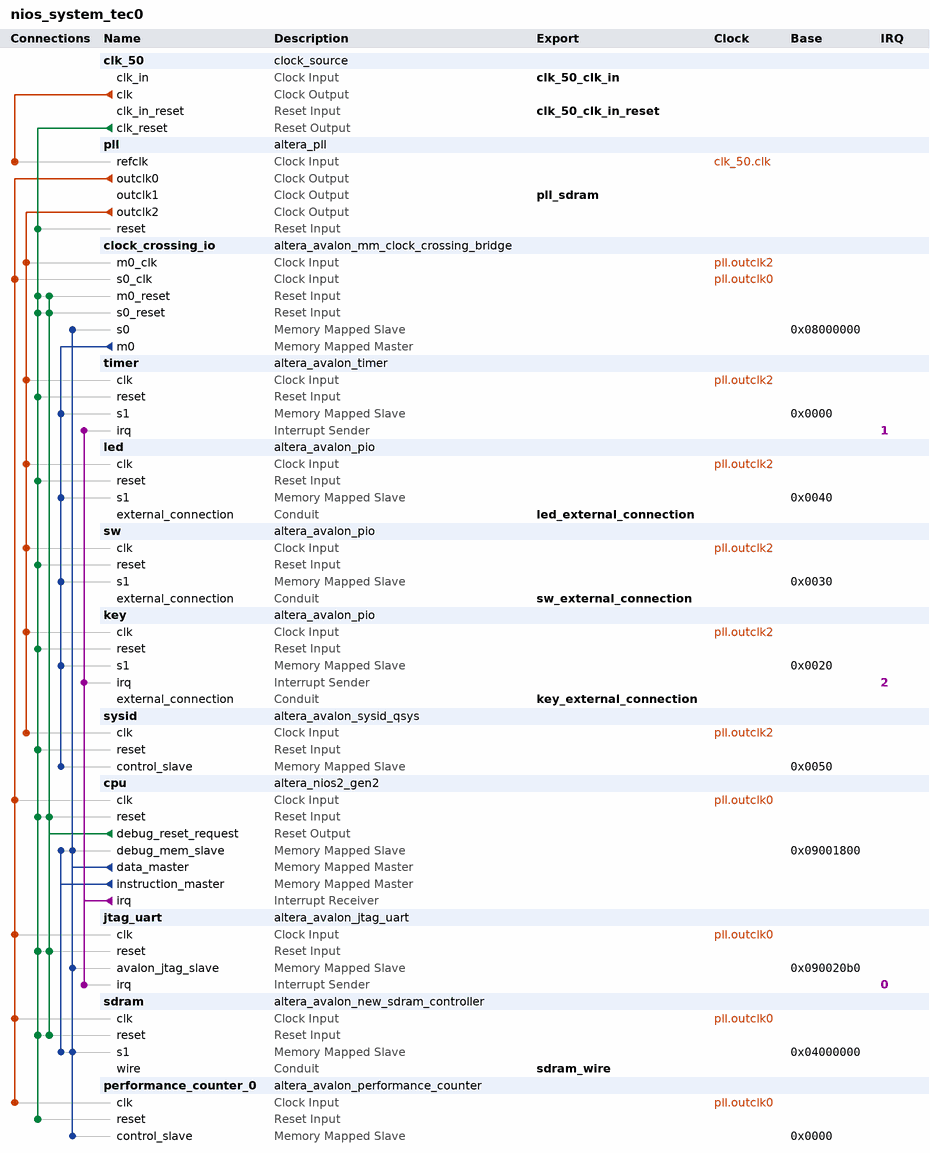
[diagram p0: system contents]
# Platform Designer (Qsys) system nios_system_tec0, Cyclone V 5CSEMA5F31C6
# Parameters at their usual value, and those the tool derives, are not listed.
package require -exact qsys 17.1
create_system nios_system_tec0
set_project_property DEVICE_FAMILY {Cyclone V}
set_project_property DEVICE 5CSEMA5F31C6

add_instance clk_50 clock_source 17.1
set_instance_parameter_value clk_50 clockFrequency 50000000

add_instance pll altera_pll 17.1
set_instance_parameter_value pll gui_device_speed_grade 2
set_instance_parameter_value pll gui_number_of_clocks 3
set_instance_parameter_value pll gui_operation_mode normal
set_instance_parameter_value pll gui_output_clock_frequency0 100.0
set_instance_parameter_value pll gui_output_clock_frequency1 100.0
set_instance_parameter_value pll gui_output_clock_frequency2 50.0
set_instance_parameter_value pll gui_phase_shift_deg1 -90.0
set_instance_parameter_value pll gui_pll_mode {Integer-N PLL}
set_instance_parameter_value pll gui_ps_units1 degrees
set_instance_parameter_value pll gui_reference_clock_frequency 50.0
set_instance_parameter_value pll gui_use_locked false

add_instance clock_crossing_io altera_avalon_mm_clock_crossing_bridge 17.1
set_instance_parameter_value clock_crossing_io ADDRESS_WIDTH 8
set_instance_parameter_value clock_crossing_io COMMAND_FIFO_DEPTH 16
set_instance_parameter_value clock_crossing_io DATA_WIDTH 32
set_instance_parameter_value clock_crossing_io MASTER_SYNC_DEPTH 3
set_instance_parameter_value clock_crossing_io MAX_BURST_SIZE 1
set_instance_parameter_value clock_crossing_io RESPONSE_FIFO_DEPTH 64
set_instance_parameter_value clock_crossing_io SLAVE_SYNC_DEPTH 3
set_instance_parameter_value clock_crossing_io USE_AUTO_ADDRESS_WIDTH 0

add_instance timer altera_avalon_timer 17.1
set_instance_parameter_value timer period 1
set_instance_parameter_value timer periodUnits MSEC

add_instance led altera_avalon_pio 17.1
set_instance_parameter_value led direction Output
set_instance_parameter_value led width 10

add_instance sw altera_avalon_pio 17.1
set_instance_parameter_value sw direction Input
set_instance_parameter_value sw width 10

add_instance key altera_avalon_pio 17.1
set_instance_parameter_value key captureEdge true
set_instance_parameter_value key direction Input
set_instance_parameter_value key edgeType FALLING
set_instance_parameter_value key generateIRQ true
set_instance_parameter_value key irqType EDGE
set_instance_parameter_value key width 4

add_instance sysid altera_avalon_sysid_qsys 17.1
set_instance_parameter_value sysid id 0

add_instance cpu altera_nios2_gen2 17.1
set_instance_parameter_value cpu dcache_size 2048
set_instance_parameter_value cpu exceptionSlave sdram.s1
set_instance_parameter_value cpu icache_size 4096
set_instance_parameter_value cpu impl Fast
set_instance_parameter_value cpu resetSlave sdram.s1
set_instance_parameter_value cpu setting_activateTrace true

add_instance jtag_uart altera_avalon_jtag_uart 17.1
set_instance_parameter_value jtag_uart simInteractiveOptions INTERACTIVE_ASCII_OUTPUT

add_instance sdram altera_avalon_new_sdram_controller 17.1
set_instance_parameter_value sdram TAC 5.4
set_instance_parameter_value sdram TRCD 20.0
set_instance_parameter_value sdram TRP 20.0
set_instance_parameter_value sdram casLatency 3
set_instance_parameter_value sdram columnWidth 10
set_instance_parameter_value sdram dataWidth 16
set_instance_parameter_value sdram generateSimulationModel false
set_instance_parameter_value sdram model custom
set_instance_parameter_value sdram numberOfBanks 4
set_instance_parameter_value sdram numberOfChipSelects 1
set_instance_parameter_value sdram powerUpDelay 100.0
set_instance_parameter_value sdram refreshPeriod 15.625
set_instance_parameter_value sdram rowWidth 13

add_instance performance_counter_0 altera_avalon_performance_counter 17.1
set_instance_parameter_value performance_counter_0 numberOfSections 7

# connections
add_connection clk_50.clk pll.refclk clock
add_connection pll.outclk0 clock_crossing_io.s0_clk clock
add_connection pll.outclk0 cpu.clk clock
add_connection pll.outclk0 jtag_uart.clk clock
add_connection pll.outclk0 performance_counter_0.clk clock
add_connection pll.outclk0 sdram.clk clock
add_connection pll.outclk2 clock_crossing_io.m0_clk clock
add_connection pll.outclk2 key.clk clock
add_connection pll.outclk2 led.clk clock
add_connection pll.outclk2 sw.clk clock
add_connection pll.outclk2 sysid.clk clock
add_connection pll.outclk2 timer.clk clock
add_connection clk_50.clk_reset clock_crossing_io.m0_reset reset
add_connection clk_50.clk_reset clock_crossing_io.s0_reset reset
add_connection clk_50.clk_reset cpu.reset reset
add_connection clk_50.clk_reset jtag_uart.reset reset
add_connection clk_50.clk_reset key.reset reset
add_connection clk_50.clk_reset led.reset reset
add_connection clk_50.clk_reset performance_counter_0.reset reset
add_connection clk_50.clk_reset pll.reset reset
add_connection clk_50.clk_reset sdram.reset reset
add_connection clk_50.clk_reset sw.reset reset
add_connection clk_50.clk_reset sysid.reset reset
add_connection clk_50.clk_reset timer.reset reset
add_connection cpu.debug_reset_request clock_crossing_io.m0_reset reset
add_connection cpu.debug_reset_request clock_crossing_io.s0_reset reset
add_connection cpu.debug_reset_request cpu.reset reset
add_connection cpu.debug_reset_request jtag_uart.reset reset
add_connection cpu.debug_reset_request sdram.reset reset
add_connection clock_crossing_io.m0 key.s1 avalon
set_connection_parameter_value clock_crossing_io.m0/key.s1 baseAddress 0x0020
add_connection clock_crossing_io.m0 led.s1 avalon
set_connection_parameter_value clock_crossing_io.m0/led.s1 baseAddress 0x0040
add_connection clock_crossing_io.m0 sw.s1 avalon
set_connection_parameter_value clock_crossing_io.m0/sw.s1 baseAddress 0x0030
add_connection clock_crossing_io.m0 sysid.control_slave avalon
set_connection_parameter_value clock_crossing_io.m0/sysid.control_slave baseAddress 0x0050
add_connection clock_crossing_io.m0 timer.s1 avalon
set_connection_parameter_value clock_crossing_io.m0/timer.s1 baseAddress 0x0000
add_connection cpu.data_master clock_crossing_io.s0 avalon
set_connection_parameter_value cpu.data_master/clock_crossing_io.s0 baseAddress 0x08000000
add_connection cpu.data_master cpu.debug_mem_slave avalon
set_connection_parameter_value cpu.data_master/cpu.debug_mem_slave baseAddress 0x09001800
add_connection cpu.data_master jtag_uart.avalon_jtag_slave avalon
set_connection_parameter_value cpu.data_master/jtag_uart.avalon_jtag_slave baseAddress 0x090020b0
add_connection cpu.data_master performance_counter_0.control_slave avalon
set_connection_parameter_value cpu.data_master/performance_counter_0.control_slave baseAddress 0x0000
add_connection cpu.data_master sdram.s1 avalon
set_connection_parameter_value cpu.data_master/sdram.s1 baseAddress 0x04000000
add_connection cpu.instruction_master cpu.debug_mem_slave avalon
set_connection_parameter_value cpu.instruction_master/cpu.debug_mem_slave baseAddress 0x09001800
add_connection cpu.instruction_master sdram.s1 avalon
set_connection_parameter_value cpu.instruction_master/sdram.s1 baseAddress 0x04000000
add_connection cpu.irq jtag_uart.irq interrupt
set_connection_parameter_value cpu.irq/jtag_uart.irq irqNumber 0
add_connection cpu.irq key.irq interrupt
set_connection_parameter_value cpu.irq/key.irq irqNumber 2
add_connection cpu.irq timer.irq interrupt
set_connection_parameter_value cpu.irq/timer.irq irqNumber 1

# exported interfaces
add_interface clk_50_clk_in clock sink
set_interface_property clk_50_clk_in EXPORT_OF clk_50.clk_in
add_interface clk_50_clk_in_reset reset sink
set_interface_property clk_50_clk_in_reset EXPORT_OF clk_50.clk_in_reset
add_interface key_external_connection conduit end
set_interface_property key_external_connection EXPORT_OF key.external_connection
add_interface led_external_connection conduit end
set_interface_property led_external_connection EXPORT_OF led.external_connection
add_interface pll_sdram clock source
set_interface_property pll_sdram EXPORT_OF pll.outclk1
add_interface sdram_wire conduit end
set_interface_property sdram_wire EXPORT_OF sdram.wire
add_interface sw_external_connection conduit end
set_interface_property sw_external_connection EXPORT_OF sw.external_connection

set_interconnect_requirement {$system} qsys_mm.clockCrossingAdapter HANDSHAKE
set_interconnect_requirement {$system} qsys_mm.maxAdditionalLatency 0

save_system nios_system_tec0.qsys
